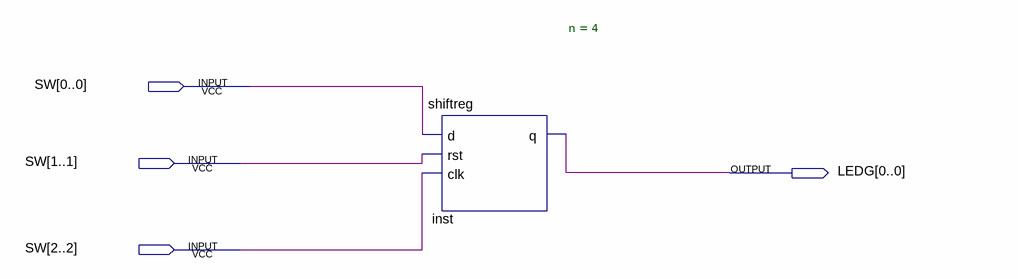
[diagram p0: schematic sheet]
// Quartus schematic shift_reg.bdf as structural Verilog: 1 symbols, 4 pins
module shift_reg (
  input  [2:0] SW,
  output [0:0] LEDG
);

  shiftreg #(.n(4)) inst (.d(SW[0]), .rst(SW[1]), .clk(SW[2]), .q(LEDG[0]));
endmodule
